# Altium schematic sheet 4_Mixer.SCHDOC
size 297 x 209 mm; SheetNumber: 13; SheetTotal: 18; DocumentName: 4_Mixer.SCHDOC
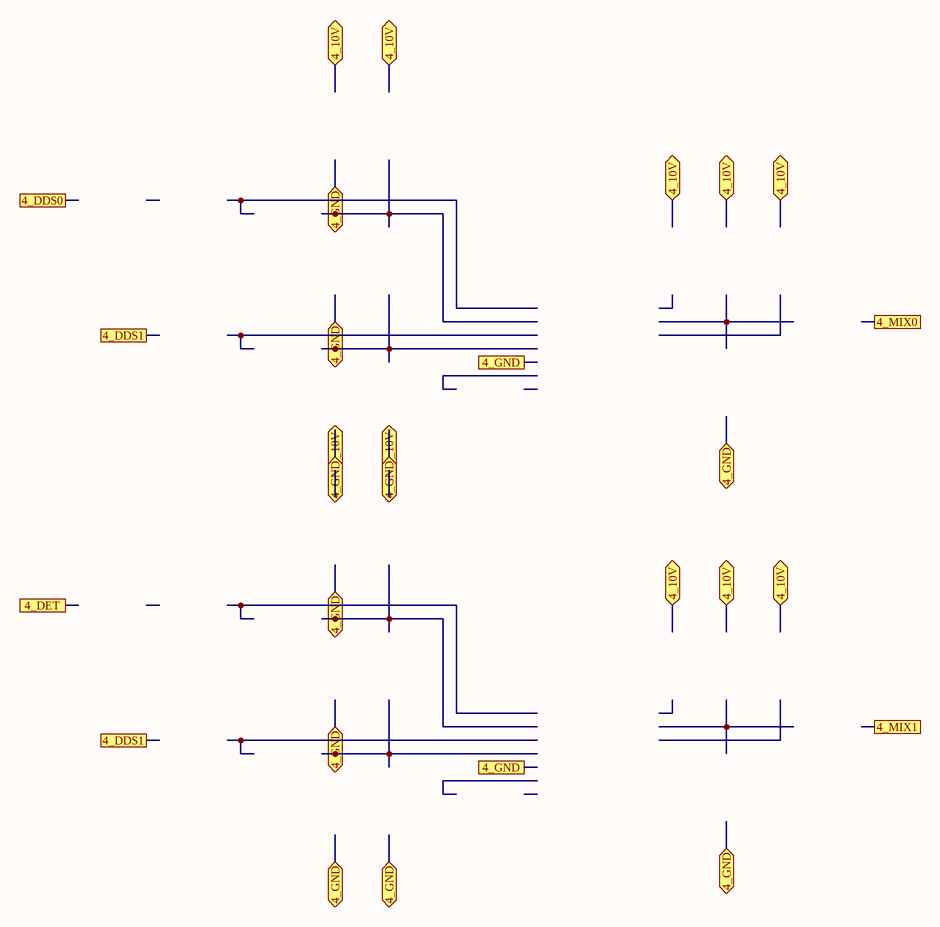
[diagram p0: 4_Mixer.SCHDOC]

## Ports
4_10V, 4_DDS0, 4_DDS1, 4_DET, 4_GND, 4_MIX0, 4_MIX1

## Notes on the sheet
- A
- B
- C
- D
- 1
- 2
- 3
- Title
- 4
- Size
- A4
- Number
- Rev
- Date
- Filename
- Drawn by
- Sheet
- of